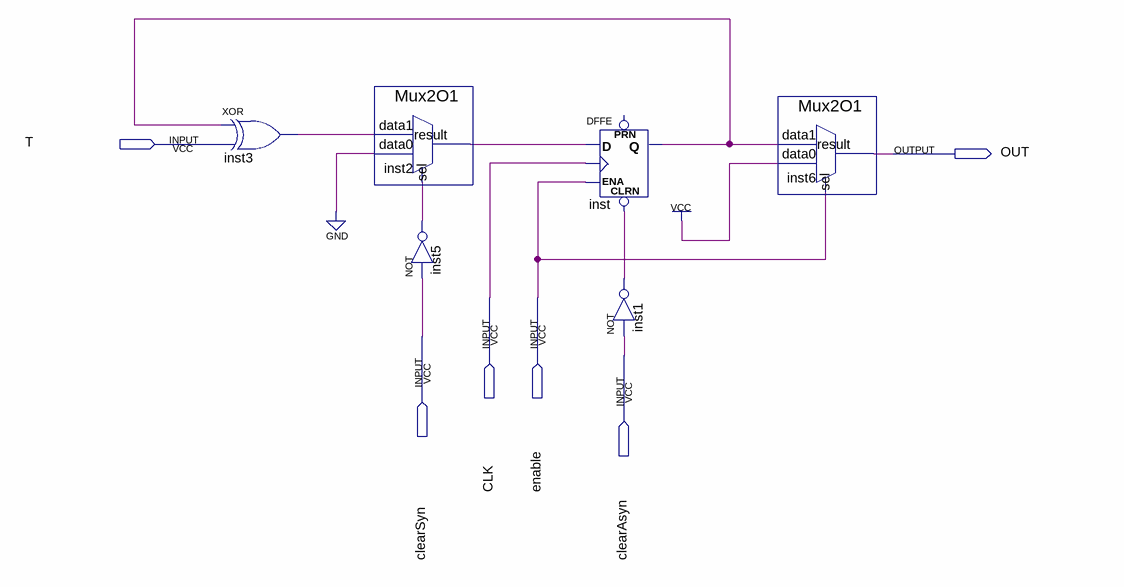
[diagram p0: schematic sheet]
// Quartus schematic counterUnit.bdf as structural Verilog: 6 symbols, 6 pins
module counterUnit (
  input  T,
  input  CLK,
  input  enable,
  input  clearSyn,
  input  clearAsyn,
  output OUT
);

  wire inst1_out, inst2_result, inst3_out, inst5_out, inst_q;

  xor inst3 (inst3_out, inst_q, T);
  Mux2O1 inst2 (.data1(inst3_out), .data0(1'b0), .sel(inst5_out), .result(inst2_result));
  not inst5 (inst5_out, clearSyn);
  DFFE inst (.CLRN(inst1_out), .D(inst2_result), .CLK(CLK), .ENA(enable), .Q(inst_q));  // open: PRN
  not inst1 (inst1_out, clearAsyn);
  Mux2O1 inst6 (.data1(inst_q), .data0(1'b1), .sel(enable), .result(OUT));
endmodule
